# EasyEDA schematic SCH_TESIS_2025-10-08_FINAL.json

## Sheets
1 Sheet_1: TITLE: Sheet_1; REV: 1.0; Date: 2025-09-09; Sheet: 1/1; Drawn By: a20195821; Company: Your Company
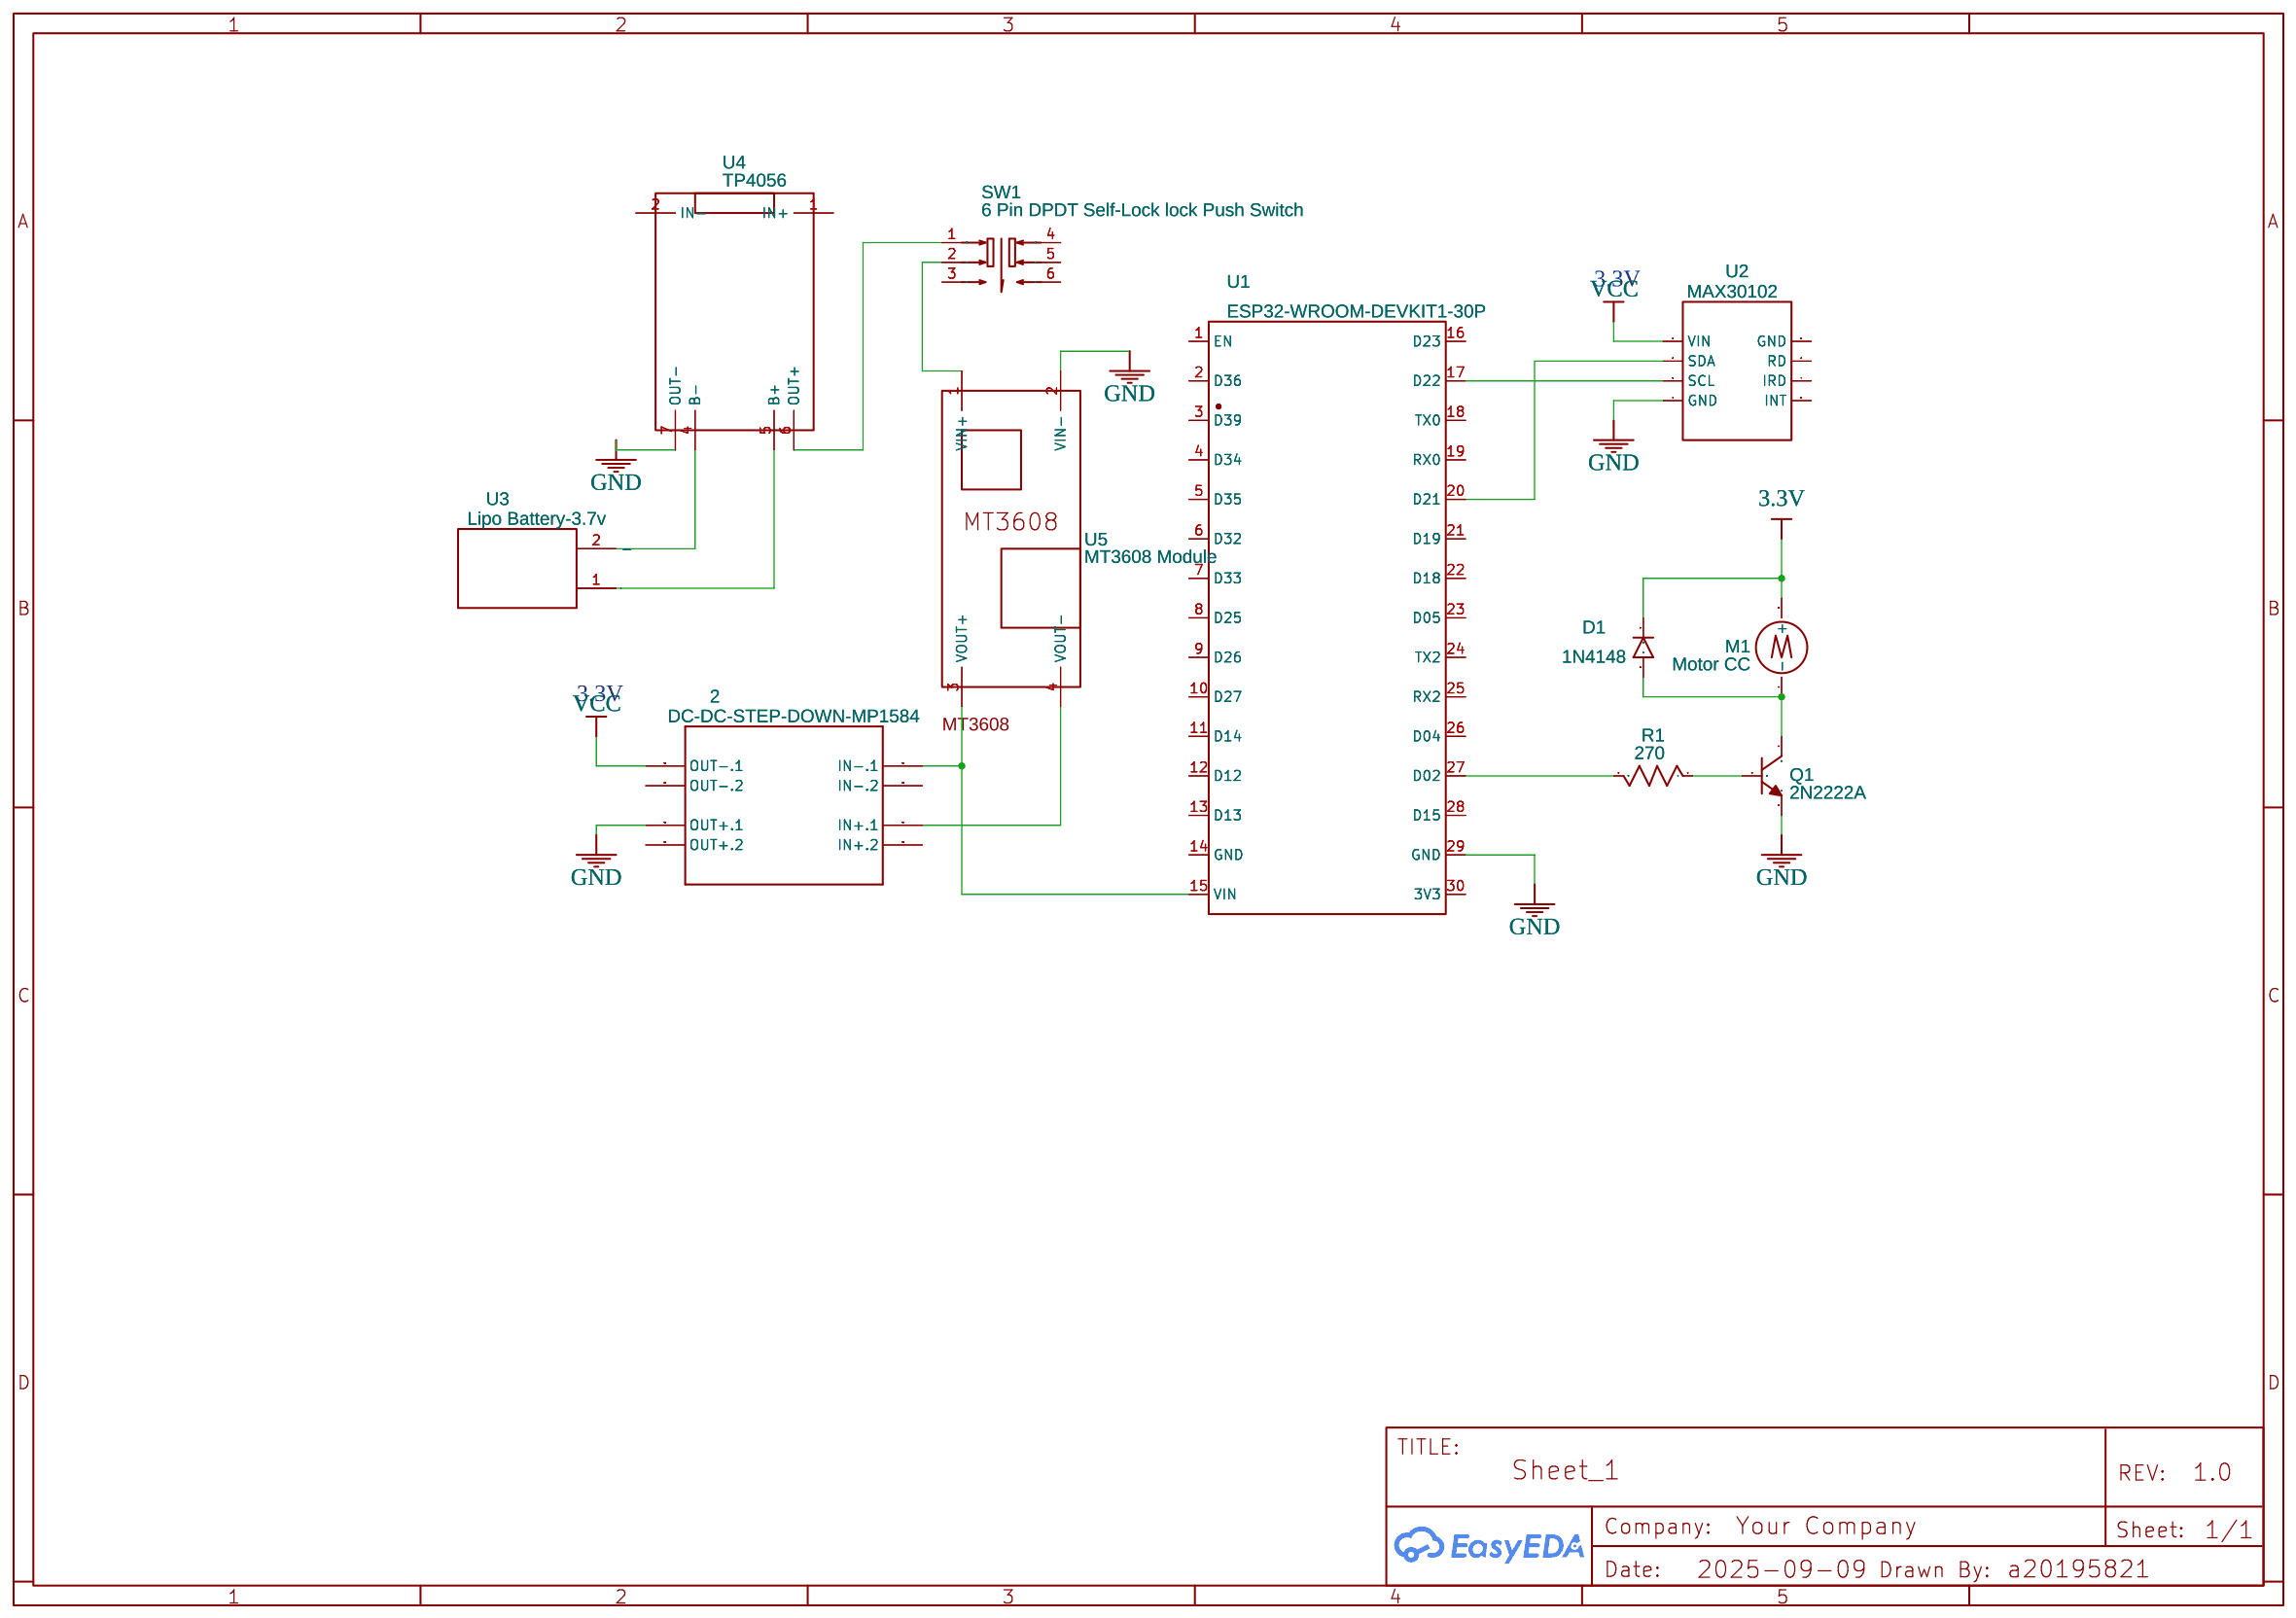
[diagram p0: Sheet_1]
2 Sheet_2: TITLE: Sheet_2; Date: 2025-10-06
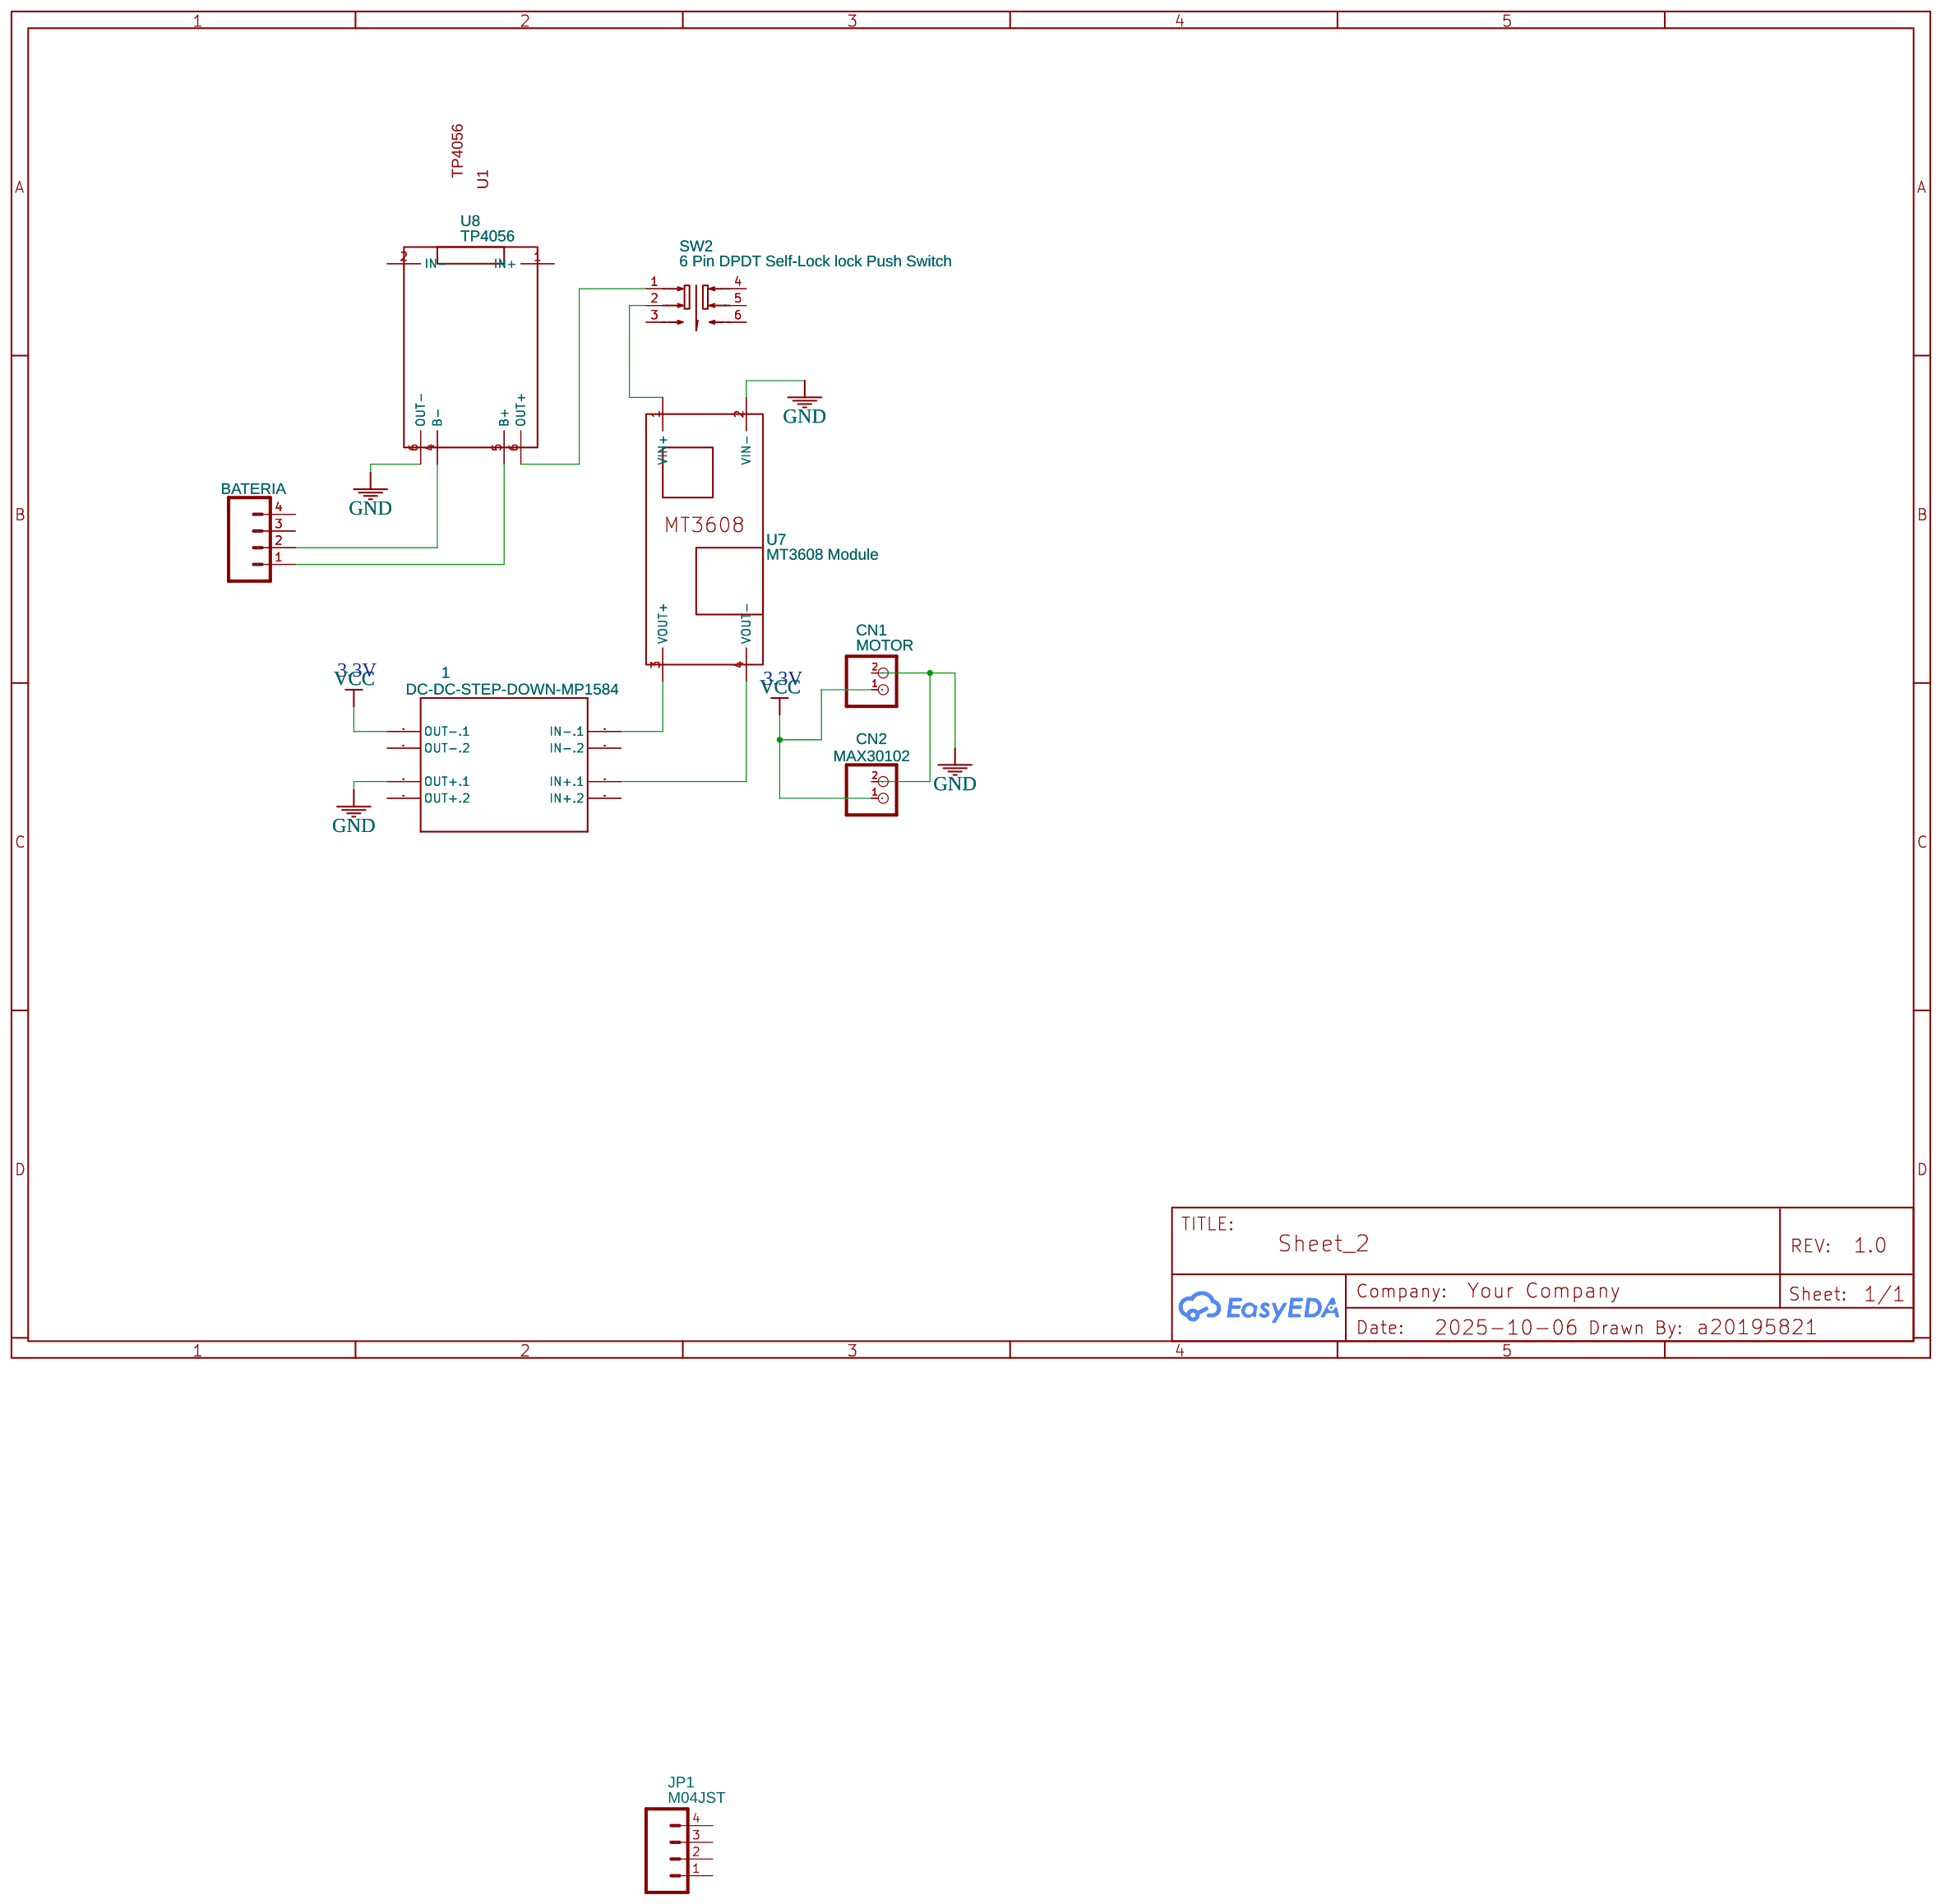
[diagram p1: Sheet_2]

## Parts
sheet Sheet_1
2  DC-DC-STEP-DOWN-MP1584  [DC-DC-STEP-DOWN-MP1584]
D1  1N4148  [1N4148_1N4148W]
M1  Motor CC  [VIBRATION MOTOR - 3V COIN TYPE VIBRATION MOTOR 10000RPM]
Q1  2N2222A  [2N222A OH]
R1  270  [R0603]
SW1  6 Pin DPDT Self-Lock lock Push Switch  [6 PIN DPDT PUSH SWITCH]
U1  ESP32-WROOM-DEVKIT1-30P  [ESP32-WROOM-DEVKIT1-30P]
U2  MAX30102  [MAX30102]
U3  Lipo Battery-3.7v  [LIPO BATTERY-3.7V]
U4  TP4056  [TP4056]
U5  MT3608 Module  [MT3608]
sheet Sheet_2
1  DC-DC-STEP-DOWN-MP1584  [DC-DC-STEP-DOWN-MP1584]
BATERIA  M04JST  [1X04-1.5MM_JST]
CN1  MOTOR  [JST-PH-2-THM]
CN2  MAX30102  [JST-PH-2-THM]
JP1  M04JST  [1X04-1.5MM_JST]
SW2  6 Pin DPDT Self-Lock lock Push Switch  [6 PIN DPDT PUSH SWITCH]
U7  MT3608 Module  [MT3608_V2]
U8  TP4056  [TP4056]

## Library data of the parts
1 2 = DC-DC-STEP-DOWN-MP1584: Contributor: Lucky1023
D1 = 1N4148: Contributor: ANDRE39
M1 = Motor CC: JLCPCB Part Class: Extended Part; Contributor: maria.p08
Q1 = 2N2222A PITT: Supplier: LCSC; Supplier Part: C358533; Manufacturer: Foshan Blue Rocket Elec; Contributor: som3a elshayeb
R1 = R_0603_US: Contributor: LCEDA_Lib
SW1 SW2 = 6 Pin DPDT Self-Lock lock Push Switch: Manufacturer: MAHA; Contributor: alif2030
U1 = ESP32-WROOM-DEVKIT1-30P: Contributor: viktor.g.stamenov
U2 = MAX30102: Contributor: ubayd2947
U3 = Lipo Battery-3.7v: Contributor: hirukasl6
U4 U8 = TP4056: Contributor: puzrin.pavel
U5 = MT3608 Module: Supplier: Aliexpress; Contributor: Athantos; Package Display: Yes
BATERIA JP1 = M04JST: Header 4; Contributor: SparkFun
CN1 CN2 = JST_2PIN: Contributor: Adafruit
U7 = MT3608 Module: Supplier: Aliexpress; Contributor: Athantos

## Nets
3.3V: D1.2 M1.2(+)
GND: 1.OUT+.1 2.OUT+.1 CN1.2(1) CN2.2(1) Q1.3(E) SW2.1(NC) U1.29(GND) U2.4(GND) U4.7(OUT-) U5.2(VIN-) U7.2(VIN-) U8.6(OUT-)
VCC: 1.OUT-.1 2.OUT-.1 CN1.1(2) CN2.1(2) U2.1(VIN)
Net-(1-IN+.1): 1.IN+.1 U7.4(VOUT-)
Net-(1-IN-.1): 1.IN-.1 U7.3(VOUT+)
Net-(2-IN+.1): 2.IN+.1 U5.4(VOUT-)
Net-(2-IN-.1): 2.IN-.1 U1.15(VIN) U5.3(VOUT+)
Net-(BATERIA-1): BATERIA.1 U8.5(B+)
Net-(BATERIA-2): BATERIA.2 U8.4(B-)
Net-(D1-1): D1.1 M1.1(-) Q1.1(C)
Net-(Q1-2): Q1.2(B) R1.1
Net-(R1-2): R1.2 U1.27(D02)
Net-(SW1-1): SW1.1(NC) U4.6(OUT+)
Net-(SW1-2): SW1.2(COM) U5.1(VIN+)
Net-(SW2-2): SW2.2(COM) U7.1(VIN+)
Net-(U1-17): U1.17(D22) U2.3(SCL)
Net-(U1-20): U1.20(D21) U2.2(SDA)
Net-(U3-1): U3.1(+) U4.5(B+)
Net-(U3-2): U3.2(-) U4.4(B-)

Not connected (* = marked no-connect by the designer): 1 IN+.2 IN-.2 OUT+.2 OUT-.2; 2 IN+.2 IN-.2 OUT+.2 OUT-.2; BATERIA 3 4; JP1 1 2 3 4; SW1 3(NO) 4(NC) 5(COM) 6(NO); SW2 3(NO) 4(NC) 5(COM) 6(NO); U1 1(EN) 2(D36) 3(D39) 4(D34) 5(D35) 6(D32) 7(D33) 8(D25) 9(D26) 10(D27) 11(D14) 12(D12) 13(D13) 14(GND) 16(D23) 18(TX0) 19(RX0) 21(D19) 22(D18) 23(D05) 24(TX2) 25(RX2) 26(D04) 28(D15) 30(3V3); U2 5(GND) 6(RD) 7(IRD) 8(INT); U4 1(IN+) 2(IN-); U8 1(IN+) 2(IN-)

## Notes on the sheets
sheet 1
- 3.3V
- 3.3V
sheet 2
- 3.3V
- 3.3V
